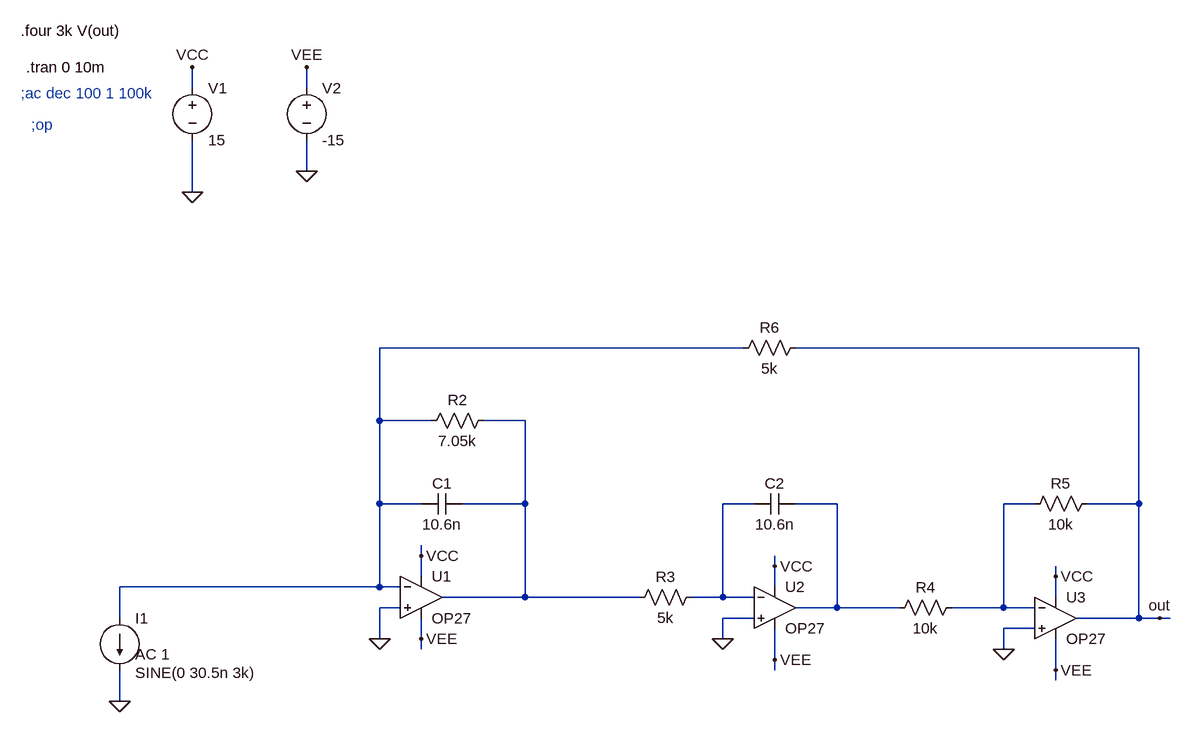
[diagram p0: schematic etaj2-AC-Transient.asc]
etaj2-AC-Transient.asc, the LTspice schematic file:
Version 4.1
SHEET 1 2284 1120
WIRE 672 -352 672 -384
WIRE 848 -352 848 -384
WIRE 848 -224 848 -272
WIRE 672 -192 672 -272
WIRE 1520 48 960 48
WIRE 2128 48 1600 48
WIRE 960 160 960 48
WIRE 1040 160 960 160
WIRE 1184 160 1120 160
WIRE 960 288 960 160
WIRE 1024 288 960 288
WIRE 1184 288 1184 160
WIRE 1184 288 1088 288
WIRE 1536 288 1488 288
WIRE 1664 288 1600 288
WIRE 1968 288 1920 288
WIRE 2128 288 2128 48
WIRE 2128 288 2048 288
WIRE 1024 368 1024 352
WIRE 1568 384 1568 368
WIRE 1024 400 1024 368
WIRE 2000 400 2000 384
WIRE 960 416 960 288
WIRE 960 416 560 416
WIRE 992 416 960 416
WIRE 1568 416 1568 384
WIRE 1184 432 1184 288
WIRE 1184 432 1056 432
WIRE 1360 432 1184 432
WIRE 1488 432 1488 288
WIRE 1488 432 1440 432
WIRE 1536 432 1488 432
WIRE 2000 432 2000 400
WIRE 992 448 960 448
WIRE 1664 448 1664 288
WIRE 1664 448 1600 448
WIRE 1760 448 1664 448
WIRE 1920 448 1920 288
WIRE 1920 448 1840 448
WIRE 1968 448 1920 448
WIRE 560 464 560 416
WIRE 1536 464 1488 464
WIRE 2128 464 2128 288
WIRE 2128 464 2032 464
WIRE 2160 464 2128 464
WIRE 2176 464 2160 464
WIRE 1968 480 1920 480
WIRE 960 496 960 448
WIRE 1024 496 1024 464
WIRE 1488 496 1488 464
WIRE 1024 512 1024 496
WIRE 1920 512 1920 480
WIRE 1568 528 1568 480
WIRE 1568 544 1568 528
WIRE 2000 544 2000 496
WIRE 2000 560 2000 544
WIRE 560 592 560 544
FLAG 672 -384 VCC
FLAG 848 -384 VEE
FLAG 960 496 0
FLAG 1488 496 0
FLAG 1920 512 0
FLAG 560 592 0
FLAG 672 -192 0
FLAG 1024 368 VCC
FLAG 1568 384 VCC
FLAG 2000 400 VCC
FLAG 1024 496 VEE
FLAG 1568 528 VEE
FLAG 2000 544 VEE
FLAG 2160 464 out
FLAG 848 -224 0
SYMBOL voltage 672 -368 R0
WINDOW 123 0 0 Left 2
WINDOW 39 0 0 Left 2
SYMATTR InstName V1
SYMATTR Value 15
SYMBOL voltage 848 -368 R0
WINDOW 123 0 0 Left 2
WINDOW 39 0 0 Left 2
SYMATTR InstName V2
SYMATTR Value -15
SYMBOL res 1136 144 R90
WINDOW 0 0 56 VBottom 2
WINDOW 3 32 56 VTop 2
SYMATTR InstName R2
SYMATTR Value 7.05k
SYMBOL res 1456 416 R90
WINDOW 0 0 56 VBottom 2
WINDOW 3 32 56 VTop 2
SYMATTR InstName R3
SYMATTR Value 5k
SYMBOL res 1856 432 R90
WINDOW 0 0 56 VBottom 2
WINDOW 3 32 56 VTop 2
SYMATTR InstName R4
SYMATTR Value 10k
SYMBOL res 2064 272 R90
WINDOW 0 0 56 VBottom 2
WINDOW 3 32 56 VTop 2
SYMATTR InstName R5
SYMATTR Value 10k
SYMBOL cap 1088 272 R90
WINDOW 0 0 32 VBottom 2
WINDOW 3 32 32 VTop 2
SYMATTR InstName C1
SYMATTR Value 10.6n
SYMBOL cap 1600 272 R90
WINDOW 0 0 32 VBottom 2
WINDOW 3 32 32 VTop 2
SYMATTR InstName C2
SYMATTR Value 10.6n
SYMBOL res 1616 32 R90
WINDOW 0 0 56 VBottom 2
WINDOW 3 32 56 VTop 2
SYMATTR InstName R6
SYMATTR Value 5k
SYMBOL OpAmps\\OP27 1024 368 R0
SYMATTR InstName U1
SYMBOL OpAmps\\OP27 1568 384 R0
SYMATTR InstName U2
SYMBOL OpAmps\\OP27 2000 400 R0
SYMATTR InstName U3
SYMBOL current 560 464 R0
WINDOW 3 24 84 Left 2
WINDOW 123 24 56 Left 2
WINDOW 39 0 0 Left 0
SYMATTR Value SINE(0 30.5n 3k)
SYMATTR Value2 AC 1
SYMATTR InstName I1
TEXT 408 -344 Left 2 ;;ac dec 100 1 100k
TEXT 424 -296 Left 2 ;;op
TEXT 416 -384 Left 2 !.tran 0 10m
TEXT 408 -440 Left 2 !.four 3k V(out)

The netlist it stands for:
* etaj2-AC-Transient.asc
V1 VCC 0 15
V2 VEE 0 -15
R2 N002 N001 7.05k
R3 N003 N002 5k
R4 N005 N004 10k
R5 out N005 10k
C1 N002 N001 10.6n
C2 N004 N003 10.6n
R6 out N001 5k
X§U1 0 N001 VCC VEE N002 OP27  ; pins In+ In- V+ V- OUT
X§U2 0 N003 VCC VEE N004 OP27  ; pins In+ In- V+ V- OUT
X§U3 0 N005 VCC VEE out OP27  ; pins In+ In- V+ V- OUT
I1 N001 0 SINE(0 30.5n 3k) AC 1
* ;ac dec 100 1 100k
* ;op
.tran 0 10m
.four 3k V(out)
.lib ADI.lib
.backanno
.end